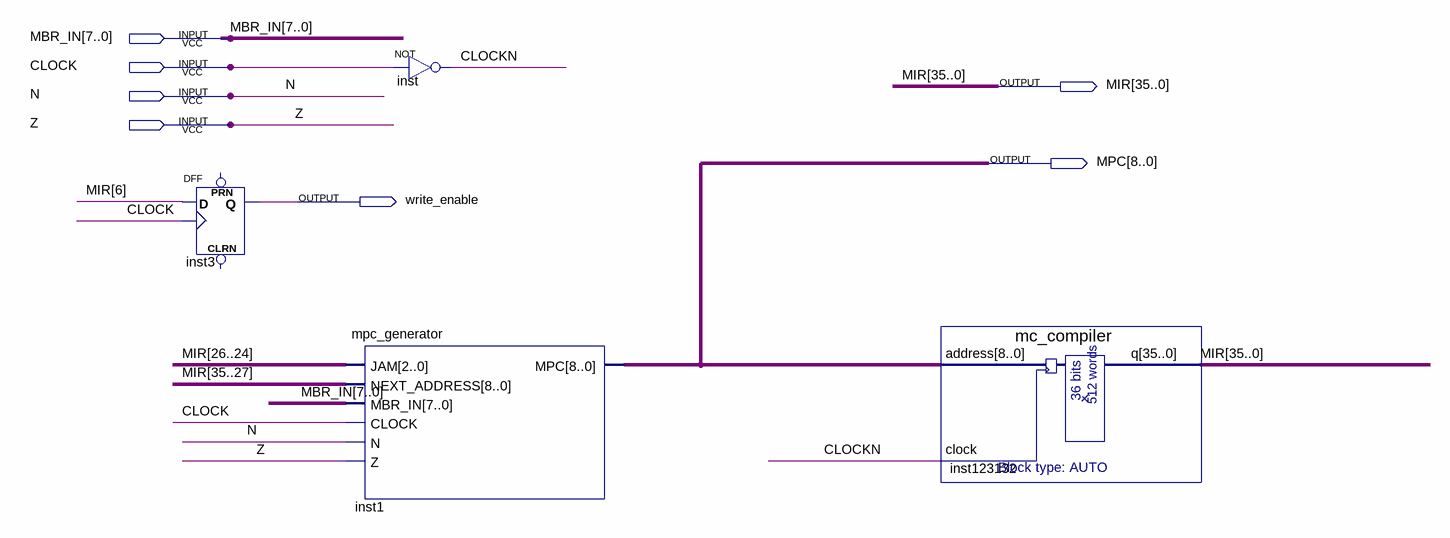
[diagram p0: schematic sheet]
// Quartus schematic CONTROL_UNIT.bdf as structural Verilog: 4 symbols, 7 pins
module CONTROL_UNIT (
  input  [7:0] MBR_IN,
  input  CLOCK,
  input  N,
  input  Z,
  output [35:0] MIR,
  output [8:0] MPC,
  output write_enable
);

  wire CLOCKN;

  DFF inst3 (.CLK(CLOCK), .D(MIR[6]), .Q(write_enable));  // open: CLRN, PRN
  mpc_generator inst1 (
    .JAM(MIR[26:24]), .NEXT_ADDRESS(MIR[35:27]), .MBR_IN(MBR_IN), .CLOCK(CLOCK), .N(N), .Z(Z), .MPC(MPC));
  not inst (CLOCKN, CLOCK);
  mc_compiler inst123132 (.address(MPC), .clock(CLOCKN), .q(MIR));
endmodule
